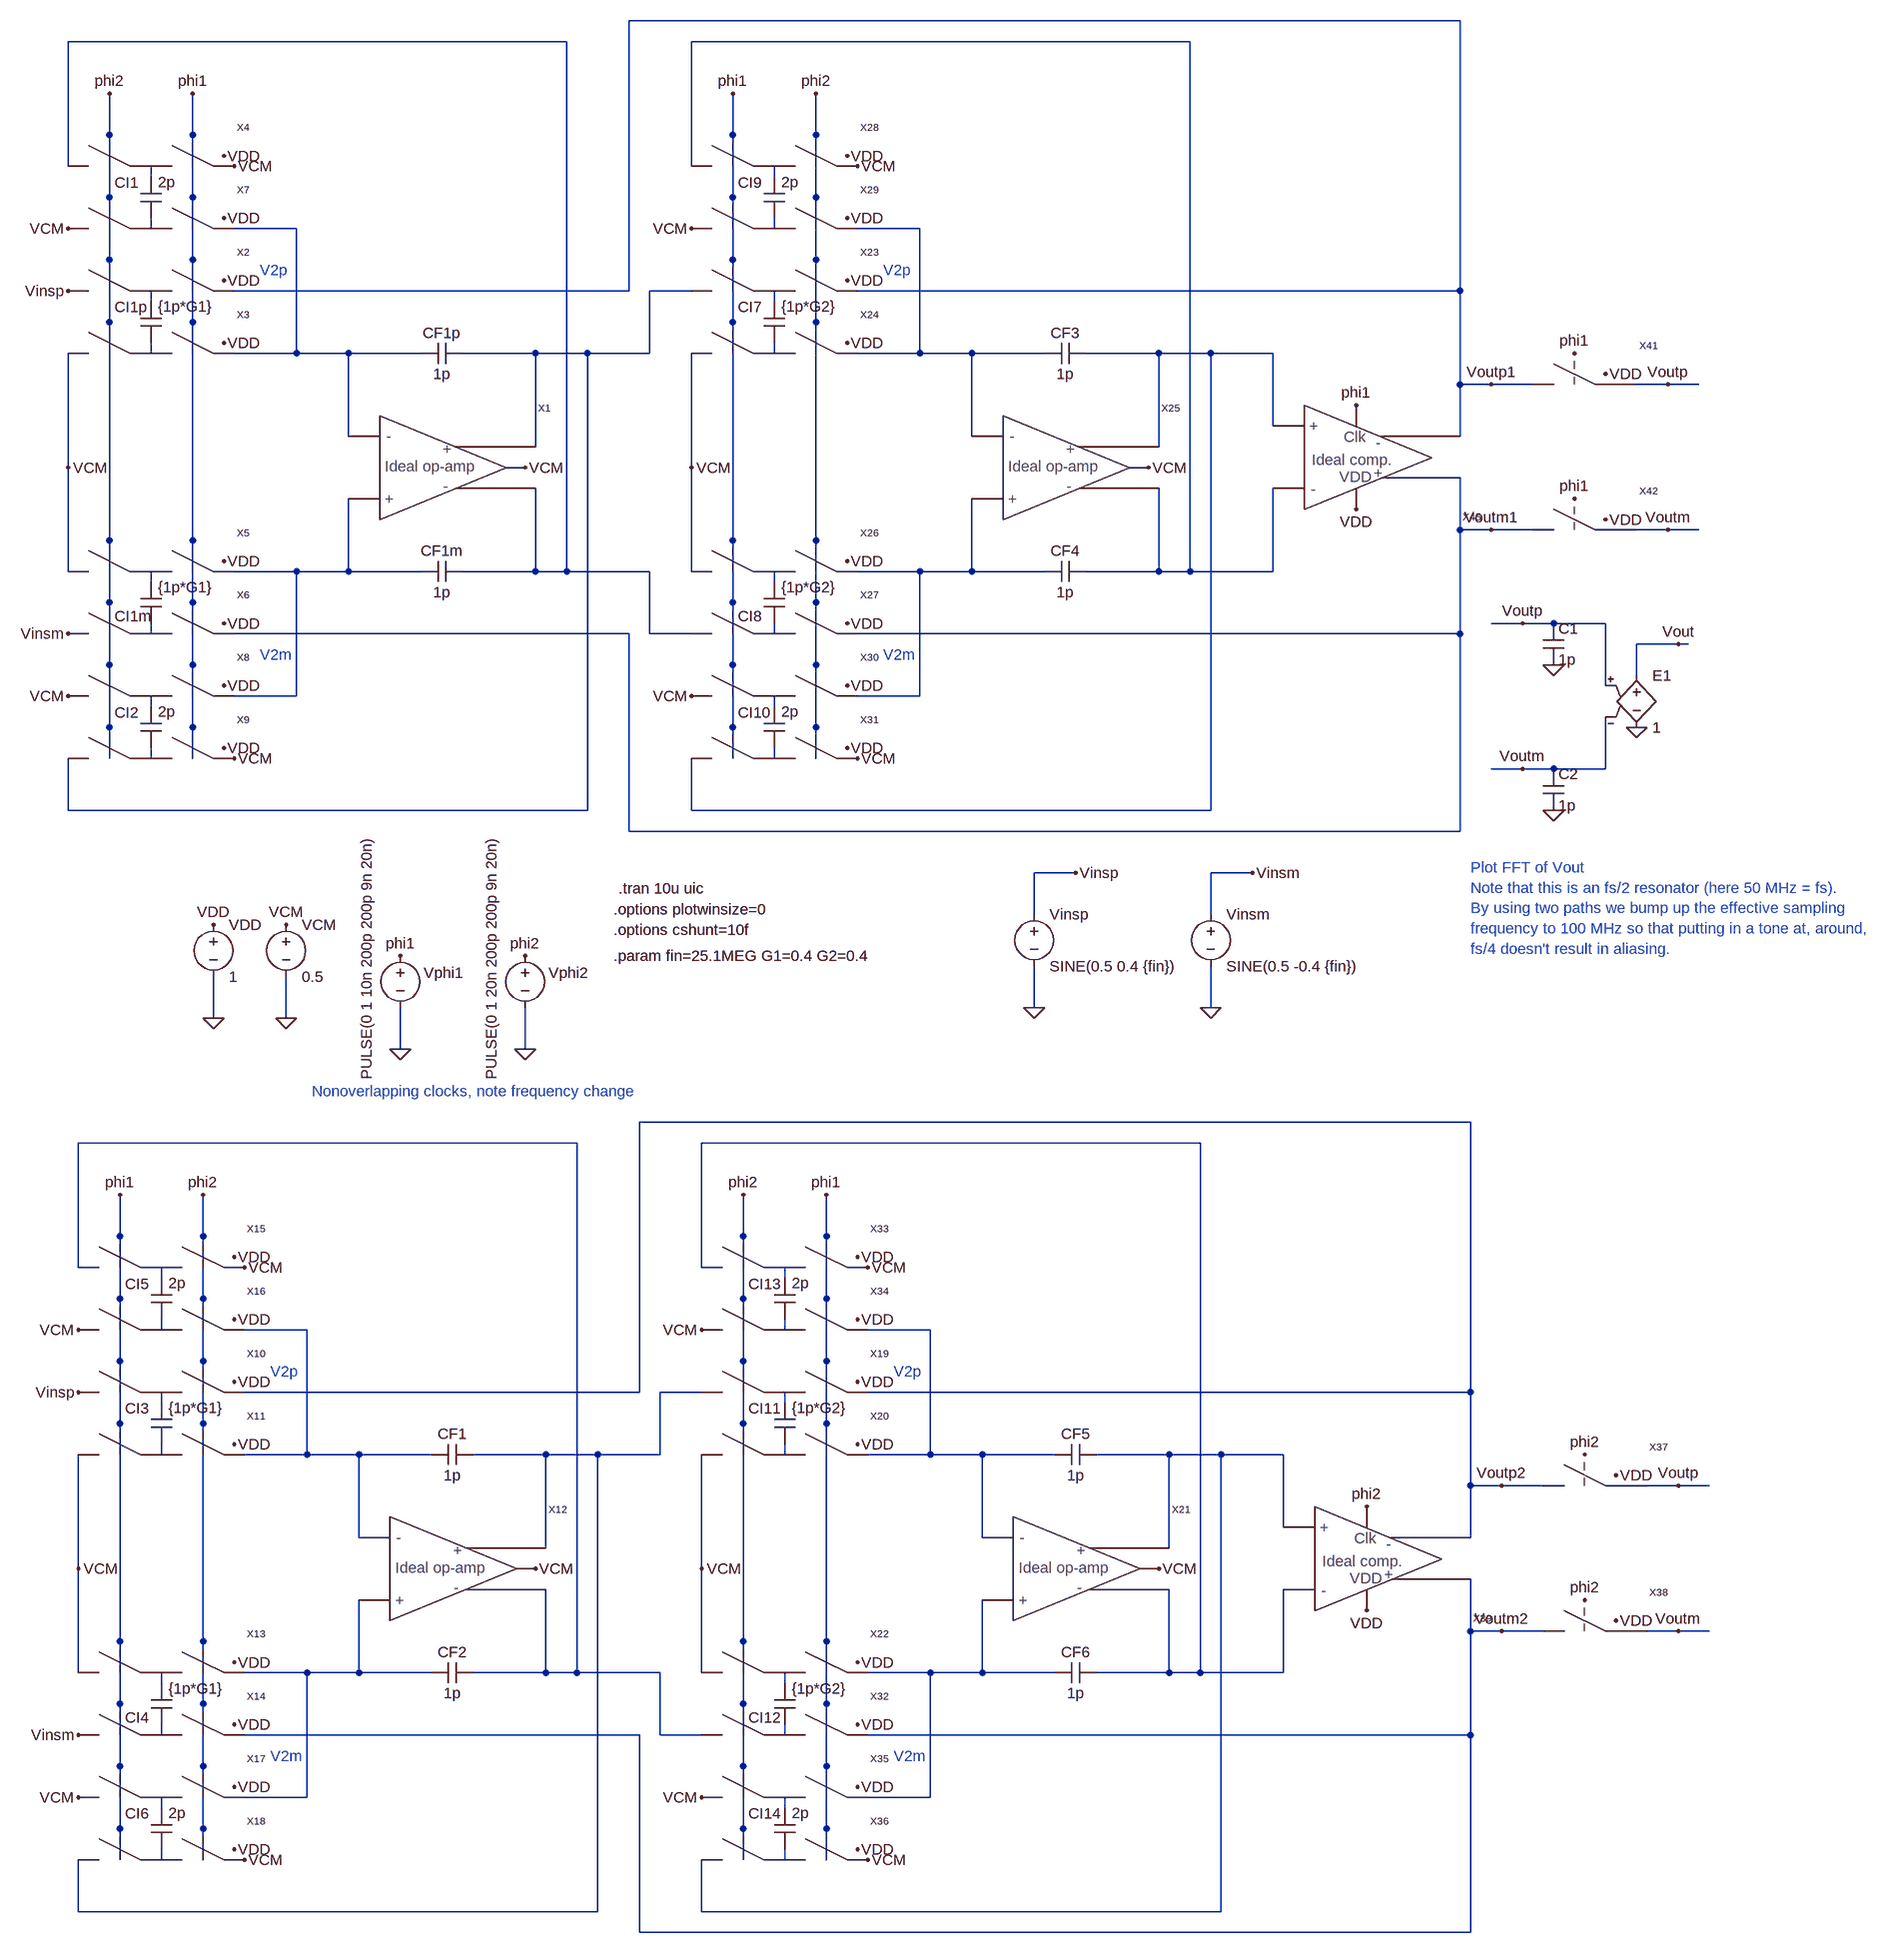
[diagram p0: schematic _Fig8_16_MSD.asc]
_Fig8_16_MSD.asc, the LTspice schematic file:
Version 4
SHEET 1 4300 2052
WIRE 3552 -896 2272 -896
WIRE 2176 -864 1408 -864
WIRE 3136 -864 2368 -864
WIRE 1472 -720 1472 -784
WIRE 1600 -720 1600 -784
WIRE 2432 -720 2432 -784
WIRE 2560 -720 2560 -784
WIRE 1408 -672 1408 -864
WIRE 2368 -672 2368 -864
WIRE 1536 -656 1536 -672
WIRE 2496 -656 2496 -672
WIRE 1472 -624 1472 -720
WIRE 1600 -624 1600 -720
WIRE 2432 -624 2432 -720
WIRE 2560 -624 2560 -720
WIRE 1536 -576 1536 -592
WIRE 1760 -576 1664 -576
WIRE 2496 -576 2496 -592
WIRE 2720 -576 2624 -576
WIRE 1472 -528 1472 -624
WIRE 1600 -528 1600 -624
WIRE 2432 -528 2432 -624
WIRE 2560 -528 2560 -624
WIRE 2272 -480 2272 -896
WIRE 2272 -480 1664 -480
WIRE 2368 -480 2304 -480
WIRE 3552 -480 3552 -896
WIRE 3552 -480 2624 -480
WIRE 1536 -464 1536 -480
WIRE 2496 -464 2496 -480
WIRE 1472 -432 1472 -528
WIRE 1600 -432 1600 -528
WIRE 2432 -432 2432 -528
WIRE 2560 -432 2560 -528
WIRE 1536 -384 1536 -400
WIRE 1760 -384 1760 -576
WIRE 1760 -384 1664 -384
WIRE 1840 -384 1760 -384
WIRE 1952 -384 1840 -384
WIRE 2128 -384 2016 -384
WIRE 2208 -384 2128 -384
WIRE 2304 -384 2304 -480
WIRE 2304 -384 2208 -384
WIRE 2496 -384 2496 -400
WIRE 2720 -384 2720 -576
WIRE 2720 -384 2624 -384
WIRE 2800 -384 2720 -384
WIRE 2912 -384 2800 -384
WIRE 3088 -384 2976 -384
WIRE 3168 -384 3088 -384
WIRE 3264 -384 3168 -384
WIRE 3552 -336 3552 -480
WIRE 3600 -336 3552 -336
WIRE 3664 -336 3600 -336
WIRE 3872 -336 3824 -336
WIRE 3920 -336 3872 -336
WIRE 3264 -272 3264 -384
WIRE 1840 -256 1840 -384
WIRE 2800 -256 2800 -384
WIRE 3552 -256 3552 -336
WIRE 2128 -240 2128 -384
WIRE 3088 -240 3088 -384
WIRE 1408 -208 1408 -384
WIRE 2368 -208 2368 -384
WIRE 3552 -112 3552 -192
WIRE 3600 -112 3552 -112
WIRE 3664 -112 3600 -112
WIRE 3872 -112 3824 -112
WIRE 3920 -112 3872 -112
WIRE 1472 -96 1472 -432
WIRE 1600 -96 1600 -432
WIRE 2432 -96 2432 -432
WIRE 2560 -96 2560 -432
WIRE 1408 -48 1408 -208
WIRE 1760 -48 1664 -48
WIRE 1840 -48 1840 -160
WIRE 1840 -48 1760 -48
WIRE 1952 -48 1840 -48
WIRE 2128 -48 2128 -176
WIRE 2128 -48 2016 -48
WIRE 2176 -48 2176 -864
WIRE 2176 -48 2128 -48
WIRE 2304 -48 2176 -48
WIRE 2368 -48 2368 -208
WIRE 2720 -48 2624 -48
WIRE 2800 -48 2800 -160
WIRE 2800 -48 2720 -48
WIRE 2912 -48 2800 -48
WIRE 3088 -48 3088 -176
WIRE 3088 -48 2976 -48
WIRE 3136 -48 3136 -864
WIRE 3136 -48 3088 -48
WIRE 3264 -48 3264 -176
WIRE 3264 -48 3136 -48
WIRE 1536 -32 1536 -48
WIRE 2496 -32 2496 -48
WIRE 1472 0 1472 -96
WIRE 1600 0 1600 -96
WIRE 2432 0 2432 -96
WIRE 2560 0 2560 -96
WIRE 3648 32 3600 32
WIRE 3696 32 3648 32
WIRE 3776 32 3696 32
WIRE 1536 48 1536 32
WIRE 2272 48 1664 48
WIRE 2304 48 2304 -48
WIRE 2368 48 2304 48
WIRE 2496 48 2496 32
WIRE 3552 48 3552 -112
WIRE 3552 48 2624 48
WIRE 3888 64 3824 64
WIRE 3904 64 3888 64
WIRE 1472 96 1472 0
WIRE 1600 96 1600 0
WIRE 2432 96 2432 0
WIRE 2560 96 2560 0
WIRE 3824 112 3824 64
WIRE 3776 128 3776 32
WIRE 1760 144 1760 -48
WIRE 1760 144 1664 144
WIRE 2720 144 2720 -48
WIRE 2720 144 2624 144
WIRE 1536 160 1536 144
WIRE 2496 160 2496 144
WIRE 1472 192 1472 96
WIRE 1600 192 1600 96
WIRE 2432 192 2432 96
WIRE 2560 192 2560 96
WIRE 1472 240 1472 192
WIRE 1536 240 1536 224
WIRE 1600 240 1600 192
WIRE 2432 240 2432 192
WIRE 2496 240 2496 224
WIRE 2560 240 2560 192
WIRE 3648 256 3600 256
WIRE 3696 256 3648 256
WIRE 3776 256 3776 176
WIRE 3776 256 3696 256
WIRE 1408 320 1408 240
WIRE 2208 320 2208 -384
WIRE 2208 320 1408 320
WIRE 2368 320 2368 240
WIRE 3168 320 3168 -384
WIRE 3168 320 2368 320
WIRE 2272 352 2272 48
WIRE 3552 352 3552 48
WIRE 3552 352 2272 352
WIRE 2960 416 2896 416
WIRE 3232 416 3168 416
WIRE 2896 480 2896 416
WIRE 3168 480 3168 416
WIRE 2896 624 2896 560
WIRE 3168 624 3168 560
WIRE 1632 640 1632 576
WIRE 1744 640 1744 576
WIRE 1920 688 1920 624
WIRE 2112 688 2112 624
WIRE 3568 800 2288 800
WIRE 2192 832 1424 832
WIRE 3152 832 2384 832
WIRE 1488 976 1488 912
WIRE 1616 976 1616 912
WIRE 2448 976 2448 912
WIRE 2576 976 2576 912
WIRE 1424 1024 1424 832
WIRE 2384 1024 2384 832
WIRE 1552 1040 1552 1024
WIRE 2512 1040 2512 1024
WIRE 1488 1072 1488 976
WIRE 1616 1072 1616 976
WIRE 2448 1072 2448 976
WIRE 2576 1072 2576 976
WIRE 1552 1120 1552 1104
WIRE 1776 1120 1680 1120
WIRE 2512 1120 2512 1104
WIRE 2736 1120 2640 1120
WIRE 1488 1168 1488 1072
WIRE 1616 1168 1616 1072
WIRE 2448 1168 2448 1072
WIRE 2576 1168 2576 1072
WIRE 2288 1216 2288 800
WIRE 2288 1216 1680 1216
WIRE 2384 1216 2320 1216
WIRE 3568 1216 3568 800
WIRE 3568 1216 2640 1216
WIRE 1552 1232 1552 1216
WIRE 2512 1232 2512 1216
WIRE 1488 1264 1488 1168
WIRE 1616 1264 1616 1168
WIRE 2448 1264 2448 1168
WIRE 2576 1264 2576 1168
WIRE 1552 1312 1552 1296
WIRE 1776 1312 1776 1120
WIRE 1776 1312 1680 1312
WIRE 1856 1312 1776 1312
WIRE 1968 1312 1856 1312
WIRE 2144 1312 2032 1312
WIRE 2224 1312 2144 1312
WIRE 2320 1312 2320 1216
WIRE 2320 1312 2224 1312
WIRE 2512 1312 2512 1296
WIRE 2736 1312 2736 1120
WIRE 2736 1312 2640 1312
WIRE 2816 1312 2736 1312
WIRE 2928 1312 2816 1312
WIRE 3104 1312 2992 1312
WIRE 3184 1312 3104 1312
WIRE 3280 1312 3184 1312
WIRE 3568 1360 3568 1216
WIRE 3616 1360 3568 1360
WIRE 3680 1360 3616 1360
WIRE 3888 1360 3840 1360
WIRE 3936 1360 3888 1360
WIRE 3280 1424 3280 1312
WIRE 1856 1440 1856 1312
WIRE 2816 1440 2816 1312
WIRE 3568 1440 3568 1360
WIRE 2144 1456 2144 1312
WIRE 3104 1456 3104 1312
WIRE 1424 1488 1424 1312
WIRE 2384 1488 2384 1312
WIRE 3568 1584 3568 1504
WIRE 3616 1584 3568 1584
WIRE 3680 1584 3616 1584
WIRE 3888 1584 3840 1584
WIRE 3936 1584 3888 1584
WIRE 1488 1600 1488 1264
WIRE 1616 1600 1616 1264
WIRE 2448 1600 2448 1264
WIRE 2576 1600 2576 1264
WIRE 1424 1648 1424 1488
WIRE 1776 1648 1680 1648
WIRE 1856 1648 1856 1536
WIRE 1856 1648 1776 1648
WIRE 1968 1648 1856 1648
WIRE 2144 1648 2144 1520
WIRE 2144 1648 2032 1648
WIRE 2192 1648 2192 832
WIRE 2192 1648 2144 1648
WIRE 2320 1648 2192 1648
WIRE 2384 1648 2384 1488
WIRE 2736 1648 2640 1648
WIRE 2816 1648 2816 1536
WIRE 2816 1648 2736 1648
WIRE 2928 1648 2816 1648
WIRE 3104 1648 3104 1520
WIRE 3104 1648 2992 1648
WIRE 3152 1648 3152 832
WIRE 3152 1648 3104 1648
WIRE 3280 1648 3280 1520
WIRE 3280 1648 3152 1648
WIRE 1552 1664 1552 1648
WIRE 2512 1664 2512 1648
WIRE 1488 1696 1488 1600
WIRE 1616 1696 1616 1600
WIRE 2448 1696 2448 1600
WIRE 2576 1696 2576 1600
WIRE 1552 1744 1552 1728
WIRE 2288 1744 1680 1744
WIRE 2320 1744 2320 1648
WIRE 2384 1744 2320 1744
WIRE 2512 1744 2512 1728
WIRE 3568 1744 3568 1584
WIRE 3568 1744 2640 1744
WIRE 1488 1792 1488 1696
WIRE 1616 1792 1616 1696
WIRE 2448 1792 2448 1696
WIRE 2576 1792 2576 1696
WIRE 1776 1840 1776 1648
WIRE 1776 1840 1680 1840
WIRE 2736 1840 2736 1648
WIRE 2736 1840 2640 1840
WIRE 1552 1856 1552 1840
WIRE 2512 1856 2512 1840
WIRE 1488 1888 1488 1792
WIRE 1616 1888 1616 1792
WIRE 2448 1888 2448 1792
WIRE 2576 1888 2576 1792
WIRE 1488 1936 1488 1888
WIRE 1552 1936 1552 1920
WIRE 1616 1936 1616 1888
WIRE 2448 1936 2448 1888
WIRE 2512 1936 2512 1920
WIRE 2576 1936 2576 1888
WIRE 1424 2016 1424 1936
WIRE 2224 2016 2224 1312
WIRE 2224 2016 1424 2016
WIRE 2384 2016 2384 1936
WIRE 3184 2016 3184 1312
WIRE 3184 2016 2384 2016
WIRE 2288 2048 2288 1744
WIRE 3568 2048 3568 1744
WIRE 3568 2048 2288 2048
FLAG 2896 624 0
FLAG 2960 416 Vinsp
FLAG 1920 688 0
FLAG 1920 544 phi1
FLAG 1632 640 0
FLAG 1632 496 VDD
FLAG 1648 -496 VDD
FLAG 1648 -400 VDD
FLAG 2112 -208 VCM
FLAG 1408 -208 VCM
FLAG 2112 688 0
FLAG 2112 544 phi2
FLAG 1744 640 0
FLAG 1744 496 VCM
FLAG 1648 -64 VDD
FLAG 1648 32 VDD
FLAG 3168 624 0
FLAG 3232 416 Vinsm
FLAG 1648 -688 VDD
FLAG 1648 -592 VDD
FLAG 1472 -784 phi2
FLAG 1600 -784 phi1
FLAG 1664 -672 VCM
FLAG 1648 128 VDD
FLAG 1648 224 VDD
FLAG 1664 240 VCM
FLAG 1408 144 VCM
FLAG 1408 -576 VCM
FLAG 1408 -480 Vinsp
FLAG 1408 48 Vinsm
FLAG 2608 -496 VDD
FLAG 2608 -400 VDD
FLAG 3072 -208 VCM
FLAG 2368 -208 VCM
FLAG 2608 -64 VDD
FLAG 2608 32 VDD
FLAG 2608 -688 VDD
FLAG 2608 -592 VDD
FLAG 2432 -784 phi1
FLAG 2560 -784 phi2
FLAG 2624 -672 VCM
FLAG 2608 128 VDD
FLAG 2608 224 VDD
FLAG 2624 240 VCM
FLAG 2368 144 VCM
FLAG 2368 -576 VCM
FLAG 3776 -352 VDD
FLAG 3776 -128 VDD
FLAG 3728 -384 phi1
FLAG 3728 -160 phi1
FLAG 3392 -304 phi1
FLAG 3392 -144 VDD
FLAG 3872 -336 Voutp
FLAG 3872 -112 Voutm
FLAG 3648 32 Voutp
FLAG 3648 256 Voutm
FLAG 3696 96 0
FLAG 3696 320 0
FLAG 3600 -336 Voutp1
FLAG 3600 -112 Voutm1
FLAG 3824 192 0
FLAG 3888 64 Vout
FLAG 1664 1200 VDD
FLAG 1664 1296 VDD
FLAG 2128 1488 VCM
FLAG 1424 1488 VCM
FLAG 1664 1632 VDD
FLAG 1664 1728 VDD
FLAG 1664 1008 VDD
FLAG 1664 1104 VDD
FLAG 1488 912 phi1
FLAG 1616 912 phi2
FLAG 1680 1024 VCM
FLAG 1664 1824 VDD
FLAG 1664 1920 VDD
FLAG 1680 1936 VCM
FLAG 1424 1840 VCM
FLAG 1424 1120 VCM
FLAG 1424 1216 Vinsp
FLAG 1424 1744 Vinsm
FLAG 2624 1200 VDD
FLAG 2624 1296 VDD
FLAG 3088 1488 VCM
FLAG 2384 1488 VCM
FLAG 2624 1632 VDD
FLAG 2624 1728 VDD
FLAG 2624 1008 VDD
FLAG 2624 1104 VDD
FLAG 2448 912 phi2
FLAG 2576 912 phi1
FLAG 2640 1024 VCM
FLAG 2624 1824 VDD
FLAG 2624 1920 VDD
FLAG 2640 1936 VCM
FLAG 2384 1840 VCM
FLAG 2384 1120 VCM
FLAG 3792 1344 VDD
FLAG 3792 1568 VDD
FLAG 3744 1312 phi2
FLAG 3744 1536 phi2
FLAG 3408 1392 phi2
FLAG 3408 1552 VDD
FLAG 3888 1360 Voutp
FLAG 3888 1584 Voutm
FLAG 3616 1360 Voutp2
FLAG 3616 1584 Voutm2
SYMBOL voltage 2896 464 R0
WINDOW 123 0 0 Left 0
WINDOW 39 0 0 Left 0
SYMATTR InstName Vinsp
SYMATTR Value SINE(0.5 0.4 {fin})
SYMBOL voltage 1920 528 R0
WINDOW 0 36 42 Left 0
WINDOW 3 -52 207 VLeft 0
WINDOW 123 0 0 Left 0
WINDOW 39 0 0 Left 0
SYMATTR InstName Vphi1
SYMATTR Value PULSE(0 1 10n 200p 200p 9n 20n)
SYMBOL voltage 1632 480 R0
WINDOW 123 0 0 Left 0
WINDOW 39 0 0 Left 0
SYMATTR InstName VDD
SYMATTR Value 1
SYMBOL switches_2 1408 -464 R0
SYMATTR InstName X2
SYMBOL switches_2 1408 -368 R0
SYMATTR InstName X3
SYMBOL cap 1952 -368 R270
WINDOW 0 32 32 VTop 0
WINDOW 3 0 32 VBottom 0
SYMATTR InstName CF1p
SYMATTR Value 1p
SYMBOL cap 1520 -464 R0
WINDOW 0 -40 9 Left 0
WINDOW 3 27 8 Left 0
SYMATTR InstName CI1p
SYMATTR Value {1p*G1}
SYMBOL voltage 2112 528 R0
WINDOW 0 36 42 Left 0
WINDOW 3 -52 207 VLeft 0
WINDOW 123 0 0 Left 0
WINDOW 39 0 0 Left 0
SYMATTR InstName Vphi2
SYMATTR Value PULSE(0 1 20n 200p 200p 9n 20n)
SYMBOL voltage 1744 480 R0
WINDOW 123 0 0 Left 0
WINDOW 39 0 0 Left 0
SYMATTR InstName VCM
SYMATTR Value 0.5
SYMBOL Ideal_differential_op_amp 1888 -208 R0
SYMATTR InstName X1
SYMBOL cap 2016 -64 R90
WINDOW 0 0 32 VBottom 0
WINDOW 3 32 32 VTop 0
SYMATTR InstName CF1m
SYMATTR Value 1p
SYMBOL switches_2 1408 -32 R0
SYMATTR InstName X5
SYMBOL switches_2 1408 64 R0
SYMATTR InstName X6
SYMBOL cap 1520 -32 R0
WINDOW 0 -40 53 Left 0
WINDOW 3 27 8 Left 0
SYMATTR InstName CI1m
SYMATTR Value {1p*G1}
SYMBOL voltage 3168 464 R0
WINDOW 123 0 0 Left 0
WINDOW 39 0 0 Left 0
SYMATTR InstName Vinsm
SYMATTR Value SINE(0.5 -0.4 {fin})
SYMBOL switches_2 1408 -656 R0
SYMATTR InstName X4
SYMBOL switches_2 1408 -560 R0
SYMATTR InstName X7
SYMBOL cap 1520 -656 R0
WINDOW 0 -40 9 Left 0
WINDOW 3 27 8 Left 0
SYMATTR InstName CI1
SYMATTR Value 2p
SYMBOL switches_2 1408 160 R0
SYMATTR InstName X8
SYMBOL switches_2 1408 256 R0
SYMATTR InstName X9
SYMBOL cap 1520 160 R0
WINDOW 0 -40 9 Left 0
WINDOW 3 27 8 Left 0
SYMATTR InstName CI2
SYMATTR Value 2p
SYMBOL switches_2 2368 -464 R0
SYMATTR InstName X23
SYMBOL switches_2 2368 -368 R0
SYMATTR InstName X24
SYMBOL cap 2912 -368 R270
WINDOW 0 32 32 VTop 0
WINDOW 3 0 32 VBottom 0
SYMATTR InstName CF3
SYMATTR Value 1p
SYMBOL cap 2480 -464 R0
WINDOW 0 -40 9 Left 0
WINDOW 3 27 8 Left 0
SYMATTR InstName CI7
SYMATTR Value {1p*G2}
SYMBOL Ideal_differential_op_amp 2848 -208 R0
SYMATTR InstName X25
SYMBOL cap 2976 -64 R90
WINDOW 0 0 32 VBottom 0
WINDOW 3 32 32 VTop 0
SYMATTR InstName CF4
SYMATTR Value 1p
SYMBOL switches_2 2368 -32 R0
SYMATTR InstName X26
SYMBOL switches_2 2368 64 R0
SYMATTR InstName X27
SYMBOL cap 2480 -32 R0
WINDOW 0 -40 53 Left 0
WINDOW 3 27 8 Left 0
SYMATTR InstName CI8
SYMATTR Value {1p*G2}
SYMBOL switches_2 2368 -656 R0
SYMATTR InstName X28
SYMBOL switches_2 2368 -560 R0
SYMATTR InstName X29
SYMBOL cap 2480 -656 R0
WINDOW 0 -40 9 Left 0
WINDOW 3 27 8 Left 0
SYMATTR InstName CI9
SYMATTR Value 2p
SYMBOL switches_2 2368 160 R0
SYMATTR InstName X30
SYMBOL switches_2 2368 256 R0
SYMATTR InstName X31
SYMBOL cap 2480 160 R0
WINDOW 0 -40 9 Left 0
WINDOW 3 27 8 Left 0
SYMATTR InstName CI10
SYMATTR Value 2p
SYMBOL switch_1 3664 -320 R0
SYMATTR InstName X41
SYMBOL switch_1 3664 -96 R0
SYMATTR InstName X42
SYMBOL Ideal_differential_clocked_comparator 3312 -224 M180
SYMATTR InstName X45
SYMBOL cap 3680 32 R0
SYMATTR InstName C1
SYMATTR Value 1p
SYMBOL cap 3680 256 R0
SYMATTR InstName C2
SYMATTR Value 1p
SYMBOL e 3824 96 R0
SYMATTR InstName E1
SYMATTR Value 1
SYMBOL switches_2 1424 1232 R0
SYMATTR InstName X10
SYMBOL switches_2 1424 1328 R0
SYMATTR InstName X11
SYMBOL cap 1968 1328 R270
WINDOW 0 32 32 VTop 0
WINDOW 3 0 32 VBottom 0
SYMATTR InstName CF1
SYMATTR Value 1p
SYMBOL cap 1536 1232 R0
WINDOW 0 -40 9 Left 0
WINDOW 3 27 8 Left 0
SYMATTR InstName CI3
SYMATTR Value {1p*G1}
SYMBOL Ideal_differential_op_amp 1904 1488 R0
SYMATTR InstName X12
SYMBOL cap 2032 1632 R90
WINDOW 0 0 32 VBottom 0
WINDOW 3 32 32 VTop 0
SYMATTR InstName CF2
SYMATTR Value 1p
SYMBOL switches_2 1424 1664 R0
SYMATTR InstName X13
SYMBOL switches_2 1424 1760 R0
SYMATTR InstName X14
SYMBOL cap 1536 1664 R0
WINDOW 0 -40 53 Left 0
WINDOW 3 27 8 Left 0
SYMATTR InstName CI4
SYMATTR Value {1p*G1}
SYMBOL switches_2 1424 1040 R0
SYMATTR InstName X15
SYMBOL switches_2 1424 1136 R0
SYMATTR InstName X16
SYMBOL cap 1536 1040 R0
WINDOW 0 -40 9 Left 0
WINDOW 3 27 8 Left 0
SYMATTR InstName CI5
SYMATTR Value 2p
SYMBOL switches_2 1424 1856 R0
SYMATTR InstName X17
SYMBOL switches_2 1424 1952 R0
SYMATTR InstName X18
SYMBOL cap 1536 1856 R0
WINDOW 0 -40 9 Left 0
WINDOW 3 27 8 Left 0
SYMATTR InstName CI6
SYMATTR Value 2p
SYMBOL switches_2 2384 1232 R0
SYMATTR InstName X19
SYMBOL switches_2 2384 1328 R0
SYMATTR InstName X20
SYMBOL cap 2928 1328 R270
WINDOW 0 32 32 VTop 0
WINDOW 3 0 32 VBottom 0
SYMATTR InstName CF5
SYMATTR Value 1p
SYMBOL cap 2496 1232 R0
WINDOW 0 -40 9 Left 0
WINDOW 3 27 8 Left 0
SYMATTR InstName CI11
SYMATTR Value {1p*G2}
SYMBOL Ideal_differential_op_amp 2864 1488 R0
SYMATTR InstName X21
SYMBOL cap 2992 1632 R90
WINDOW 0 0 32 VBottom 0
WINDOW 3 32 32 VTop 0
SYMATTR InstName CF6
SYMATTR Value 1p
SYMBOL switches_2 2384 1664 R0
SYMATTR InstName X22
SYMBOL switches_2 2384 1760 R0
SYMATTR InstName X32
SYMBOL cap 2496 1664 R0
WINDOW 0 -40 53 Left 0
WINDOW 3 27 8 Left 0
SYMATTR InstName CI12
SYMATTR Value {1p*G2}
SYMBOL switches_2 2384 1040 R0
SYMATTR InstName X33
SYMBOL switches_2 2384 1136 R0
SYMATTR InstName X34
SYMBOL cap 2496 1040 R0
WINDOW 0 -40 9 Left 0
WINDOW 3 27 8 Left 0
SYMATTR InstName CI13
SYMATTR Value 2p
SYMBOL switches_2 2384 1856 R0
SYMATTR InstName X35
SYMBOL switches_2 2384 1952 R0
SYMATTR InstName X36
SYMBOL cap 2496 1856 R0
WINDOW 0 -40 9 Left 0
WINDOW 3 27 8 Left 0
SYMATTR InstName CI14
SYMATTR Value 2p
SYMBOL switch_1 3680 1376 R0
SYMATTR InstName X37
SYMBOL switch_1 3680 1600 R0
SYMATTR InstName X38
SYMBOL Ideal_differential_clocked_comparator 3328 1472 M180
SYMATTR InstName X39
TEXT 2256 440 Left 0 !.tran 10u uic
TEXT 1784 752 Left 0 ;Nonoverlapping clocks, note frequency change
TEXT 2248 472 Left 0 !.options plotwinsize=0
TEXT 1704 -512 Left 0 ;V2p
TEXT 1704 80 Left 0 ;V2m
TEXT 2248 504 Left 0 !.options cshunt=10f
TEXT 2248 544 Left 0 !.param fin=25.1MEG G1=0.4 G2=0.4
TEXT 2664 -512 Left 0 ;V2p
TEXT 2664 80 Left 0 ;V2m
TEXT 3568 408 Left 0 ;Plot FFT of Vout\nNote that this is an fs/2 resonator (here 50 MHz = fs).\nBy using two paths we bump up the effective sampling \nfrequency to 100 MHz so that putting in a tone at, around,\nfs/4 doesn't result in aliasing.
TEXT 1720 1184 Left 0 ;V2p
TEXT 1720 1776 Left 0 ;V2m
TEXT 2680 1184 Left 0 ;V2p
TEXT 2680 1776 Left 0 ;V2m

The netlist it stands for:
* _Fig8_16_MSD.asc
Vinsp Vinsp 0 SINE(0.5 0.4 {fin})
Vphi1 phi1 0 PULSE(0 1 10n 200p 200p 9n 20n)
VDD VDD 0 1
XX2 Vinsp phi2 phi1 Voutp1 VDD N010 switches_2  ; pins P1 clk1 Clk2 P3 VDD P2
XX3 VCM phi2 phi1 N006 VDD N012 switches_2  ; pins P1 clk1 Clk2 P3 VDD P2
CF1p N006 N009 1p
CI1p N010 N012 {1p*G1}
Vphi2 phi2 0 PULSE(0 1 20n 200p 200p 9n 20n)
VCM VCM 0 0.5
XX1 N006 N015 N009 VCM N001 Ideal_differential_op_amp  ; pins Vinm Vinp Outp VCM Outm
CF1m N001 N015 1p
XX5 VCM phi2 phi1 N015 VDD N017 switches_2  ; pins P1 clk1 Clk2 P3 VDD P2
XX6 Vinsm phi2 phi1 Voutm1 VDD N019 switches_2  ; pins P1 clk1 Clk2 P3 VDD P2
CI1m N017 N019 {1p*G1}
Vinsm Vinsm 0 SINE(0.5 -0.4 {fin})
XX4 N001 phi2 phi1 VCM VDD N003 switches_2  ; pins P1 clk1 Clk2 P3 VDD P2
XX7 VCM phi2 phi1 N006 VDD N005 switches_2  ; pins P1 clk1 Clk2 P3 VDD P2
CI1 N003 N005 2p
XX8 VCM phi2 phi1 N015 VDD N021 switches_2  ; pins P1 clk1 Clk2 P3 VDD P2
XX9 N009 phi2 phi1 VCM VDD N023 switches_2  ; pins P1 clk1 Clk2 P3 VDD P2
CI2 N021 N023 2p
XX23 N009 phi1 phi2 Voutp1 VDD N011 switches_2  ; pins P1 clk1 Clk2 P3 VDD P2
XX24 VCM phi1 phi2 N008 VDD N013 switches_2  ; pins P1 clk1 Clk2 P3 VDD P2
CF3 N008 N014 1p
CI7 N011 N013 {1p*G2}
XX25 N008 N016 N014 VCM N002 Ideal_differential_op_amp  ; pins Vinm Vinp Outp VCM Outm
CF4 N002 N016 1p
XX26 VCM phi1 phi2 N016 VDD N018 switches_2  ; pins P1 clk1 Clk2 P3 VDD P2
XX27 N001 phi1 phi2 Voutm1 VDD N020 switches_2  ; pins P1 clk1 Clk2 P3 VDD P2
CI8 N018 N020 {1p*G2}
XX28 N002 phi1 phi2 VCM VDD N004 switches_2  ; pins P1 clk1 Clk2 P3 VDD P2
XX29 VCM phi1 phi2 N008 VDD N007 switches_2  ; pins P1 clk1 Clk2 P3 VDD P2
CI9 N004 N007 2p
XX30 VCM phi1 phi2 N016 VDD N022 switches_2  ; pins P1 clk1 Clk2 P3 VDD P2
XX31 N014 phi1 phi2 VCM VDD N024 switches_2  ; pins P1 clk1 Clk2 P3 VDD P2
CI10 N022 N024 2p
XX41 Voutp1 Voutp phi1 VDD switch_1  ; pins P1 P2 clk VDD
XX42 Voutm1 Voutm phi1 VDD switch_1  ; pins P1 P2 clk VDD
XX45 N002 N014 Voutm1 VDD phi1 Voutp1 Ideal_differential_clocked_comparator  ; pins Vinm Vinp Voutp VDD Clock Voutm
C1 Voutp 0 1p
C2 Voutm 0 1p
E1 Vout 0 Voutp Voutm 1
XX10 Vinsp phi1 phi2 Voutp2 VDD N034 switches_2  ; pins P1 clk1 Clk2 P3 VDD P2
XX11 VCM phi1 phi2 N030 VDD N036 switches_2  ; pins P1 clk1 Clk2 P3 VDD P2
CF1 N030 N033 1p
CI3 N034 N036 {1p*G1}
XX12 N030 N039 N033 VCM N025 Ideal_differential_op_amp  ; pins Vinm Vinp Outp VCM Outm
CF2 N025 N039 1p
XX13 VCM phi1 phi2 N039 VDD N041 switches_2  ; pins P1 clk1 Clk2 P3 VDD P2
XX14 Vinsm phi1 phi2 Voutm2 VDD N043 switches_2  ; pins P1 clk1 Clk2 P3 VDD P2
CI4 N041 N043 {1p*G1}
XX15 N025 phi1 phi2 VCM VDD N027 switches_2  ; pins P1 clk1 Clk2 P3 VDD P2
XX16 VCM phi1 phi2 N030 VDD N029 switches_2  ; pins P1 clk1 Clk2 P3 VDD P2
CI5 N027 N029 2p
XX17 VCM phi1 phi2 N039 VDD N045 switches_2  ; pins P1 clk1 Clk2 P3 VDD P2
XX18 N033 phi1 phi2 VCM VDD N047 switches_2  ; pins P1 clk1 Clk2 P3 VDD P2
CI6 N045 N047 2p
XX19 N033 phi2 phi1 Voutp2 VDD N035 switches_2  ; pins P1 clk1 Clk2 P3 VDD P2
XX20 VCM phi2 phi1 N032 VDD N037 switches_2  ; pins P1 clk1 Clk2 P3 VDD P2
CF5 N032 N038 1p
CI11 N035 N037 {1p*G2}
XX21 N032 N040 N038 VCM N026 Ideal_differential_op_amp  ; pins Vinm Vinp Outp VCM Outm
CF6 N026 N040 1p
XX22 VCM phi2 phi1 N040 VDD N042 switches_2  ; pins P1 clk1 Clk2 P3 VDD P2
XX32 N025 phi2 phi1 Voutm2 VDD N044 switches_2  ; pins P1 clk1 Clk2 P3 VDD P2
CI12 N042 N044 {1p*G2}
XX33 N026 phi2 phi1 VCM VDD N028 switches_2  ; pins P1 clk1 Clk2 P3 VDD P2
XX34 VCM phi2 phi1 N032 VDD N031 switches_2  ; pins P1 clk1 Clk2 P3 VDD P2
CI13 N028 N031 2p
XX35 VCM phi2 phi1 N040 VDD N046 switches_2  ; pins P1 clk1 Clk2 P3 VDD P2
XX36 N038 phi2 phi1 VCM VDD N048 switches_2  ; pins P1 clk1 Clk2 P3 VDD P2
CI14 N046 N048 2p
XX37 Voutp2 Voutp phi2 VDD switch_1  ; pins P1 P2 clk VDD
XX38 Voutm2 Voutm phi2 VDD switch_1  ; pins P1 P2 clk VDD
XX39 N026 N038 Voutm2 VDD phi2 Voutp2 Ideal_differential_clocked_comparator  ; pins Vinm Vinp Voutp VDD Clock Voutm
.tran 10u uic
* Nonoverlapping clocks, note frequency change
.options plotwinsize=0
* V2p
* V2m
.options cshunt=10f
.param fin=25.1MEG G1=0.4 G2=0.4
* V2p
* V2m
* Plot FFT of Vout
* Note that this is an fs/2 resonator (here 50 MHz = fs).
* By using two paths we bump up the effective sampling
* frequency to 100 MHz so that putting in a tone at, around,
* fs/4 doesn't result in aliasing.
* V2p
* V2m
* V2p
* V2m
.backanno
.end